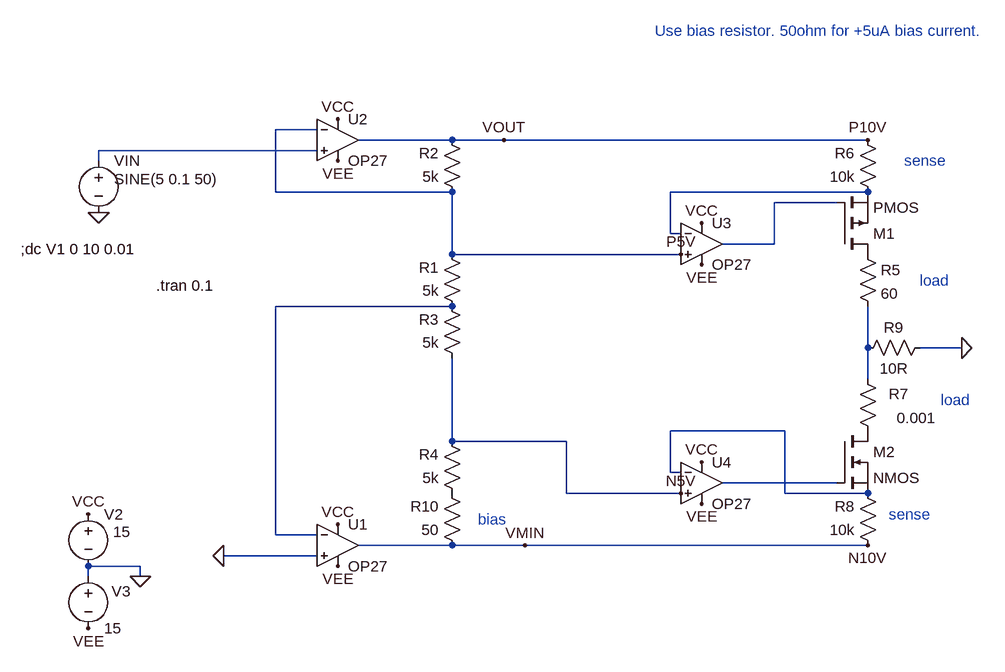
[diagram p0: schematic Draft31.asc]
Draft31.asc, the LTspice schematic file:
Version 4
SHEET 1 1452 940
WIRE 384 80 320 80
WIRE 592 96 448 96
WIRE 672 96 592 96
WIRE 1232 96 672 96
WIRE 384 112 48 112
WIRE 48 128 48 112
WIRE 320 176 320 80
WIRE 592 176 320 176
WIRE 1232 176 928 176
WIRE 1184 192 1088 192
WIRE 928 240 928 176
WIRE 944 240 928 240
WIRE 1088 256 1088 192
WIRE 1088 256 1008 256
WIRE 592 272 592 176
WIRE 944 272 592 272
WIRE 592 352 320 352
WIRE 1232 416 1232 352
WIRE 1376 416 1312 416
WIRE 1232 464 1232 416
WIRE 1104 544 928 544
WIRE 592 560 592 432
WIRE 768 560 592 560
WIRE 928 608 928 544
WIRE 944 608 928 608
WIRE 1184 624 1008 624
WIRE 768 640 768 560
WIRE 944 640 768 640
WIRE 1104 640 1104 544
WIRE 1232 640 1104 640
WIRE 320 704 320 352
WIRE 384 704 320 704
WIRE 592 720 448 720
WIRE 704 720 592 720
WIRE 1232 720 704 720
WIRE 384 736 240 736
WIRE 112 752 32 752
WIRE 32 768 32 752
WIRE 112 768 112 752
FLAG 48 208 0
FLAG 112 768 0
FLAG 672 96 VOUT
FLAG 32 672 VCC
FLAG 416 64 VCC
FLAG 32 848 VEE
FLAG 416 128 VEE
FLAG 416 688 VCC
FLAG 416 752 VEE
FLAG 704 720 VMIN
FLAG 240 736 0
FLAG 1232 96 P10V
FLAG 976 224 VCC
FLAG 976 288 VEE
FLAG 944 272 P5V
FLAG 976 592 VCC
FLAG 976 656 VEE
FLAG 1376 416 0
FLAG 1232 720 N10V
FLAG 944 640 N5V
SYMBOL voltage 48 112 R0
WINDOW 123 0 0 Left 0
WINDOW 39 0 0 Left 0
WINDOW 3 24 44 Left 2
SYMATTR Value SINE(5 0.1 50)
SYMATTR InstName VIN
SYMBOL voltage 32 656 R0
WINDOW 123 0 0 Left 0
WINDOW 39 0 0 Left 0
WINDOW 3 38 43 Left 2
SYMATTR Value 15
SYMATTR InstName V2
SYMBOL voltage 32 752 R0
WINDOW 123 0 0 Left 0
WINDOW 39 0 0 Left 0
WINDOW 0 36 39 Left 2
SYMATTR InstName V3
SYMATTR Value 15
SYMBOL res 608 192 R180
WINDOW 0 36 76 Left 2
WINDOW 3 36 40 Left 2
SYMATTR InstName R2
SYMATTR Value 5k
SYMBOL res 608 448 R180
WINDOW 0 36 76 Left 2
WINDOW 3 36 40 Left 2
SYMATTR InstName R3
SYMATTR Value 5k
SYMBOL OpAmps\\OP27 416 32 R0
SYMATTR InstName U2
SYMBOL OpAmps\\OP27 416 656 R0
SYMATTR InstName U1
SYMBOL res 608 368 R180
WINDOW 0 36 76 Left 2
WINDOW 3 36 40 Left 2
SYMATTR InstName R1
SYMATTR Value 5k
SYMBOL res 608 656 R180
WINDOW 0 36 76 Left 2
WINDOW 3 36 40 Left 2
SYMATTR InstName R4
SYMATTR Value 5k
SYMBOL res 1216 256 R0
SYMATTR InstName R5
SYMATTR Value 60
SYMBOL OpAmps\\OP27 976 192 R0
SYMATTR InstName U3
SYMBOL res 1248 192 R180
WINDOW 0 36 76 Left 2
WINDOW 3 36 40 Left 2
SYMATTR InstName R6
SYMATTR Value 10k
SYMBOL pmos 1184 272 M180
SYMATTR InstName M1
SYMBOL res 1248 560 R180
WINDOW 0 -47 73 Left 2
WINDOW 3 -89 36 Left 2
SYMATTR InstName R7
SYMATTR Value 0.001
SYMBOL OpAmps\\OP27 976 560 R0
SYMATTR InstName U4
SYMBOL res 1248 736 R180
WINDOW 0 36 76 Left 2
WINDOW 3 36 40 Left 2
SYMATTR InstName R8
SYMATTR Value 10k
SYMBOL nmos 1184 544 R0
SYMATTR InstName M2
SYMBOL res 1328 400 R90
WINDOW 0 0 56 VBottom 2
WINDOW 3 32 56 VTop 2
SYMATTR InstName R9
SYMATTR Value 10R
SYMBOL res 608 736 R180
WINDOW 0 36 76 Left 2
WINDOW 3 36 40 Left 2
SYMATTR InstName R10
SYMATTR Value 50
TEXT -72 264 Left 2 !;dc V1 0 10 0.01
TEXT 136 320 Left 2 !.tran 0.1
TEXT 1288 128 Left 2 ;sense
TEXT 1312 312 Left 2 ;load
TEXT 1264 672 Left 2 ;sense
TEXT 1344 496 Left 2 ;load
TEXT 904 -72 Left 2 ;Use bias resistor. 50ohm for +5uA bias current.
TEXT 632 680 Left 2 ;bias

The netlist it stands for:
* Draft31.asc
VIN N001 0 SINE(5 0.1 50)
V2 VCC 0 15
V3 0 VEE 15
R2 P5V P10V 5k
R3 N5V N004 5k
XU2 N001 P5V VCC VEE P10V OP27  ; pins In+ In- V+ V- OUT
XU1 0 N004 VCC VEE N10V OP27  ; pins In+ In- V+ V- OUT
R1 N004 P5V 5k
R4 P001 N5V 5k
R5 P002 N005 60
XU3 P5V N002 VCC VEE N003 OP27  ; pins In+ In- V+ V- OUT
R6 N002 P10V 10k
M1 P002 N003 N002 N002 PMOS
R7 P003 N005 0.001
XU4 N5V N006 VCC VEE N007 OP27  ; pins In+ In- V+ V- OUT
R8 N10V N006 10k
M2 P003 N007 N006 N006 NMOS
R9 0 N005 10R
R10 N10V P001 50
.model NMOS NMOS
.model PMOS PMOS
.lib standard.mos
;dc V1 0 10 0.01
.tran 0.1
* sense
* load
* sense
* load
* Use bias resistor. 50ohm for +5uA bias current.
* bias
.lib ADI.lib
.backanno
.end

* Results of the author's LTspice run, read from the files saved beside the schematic
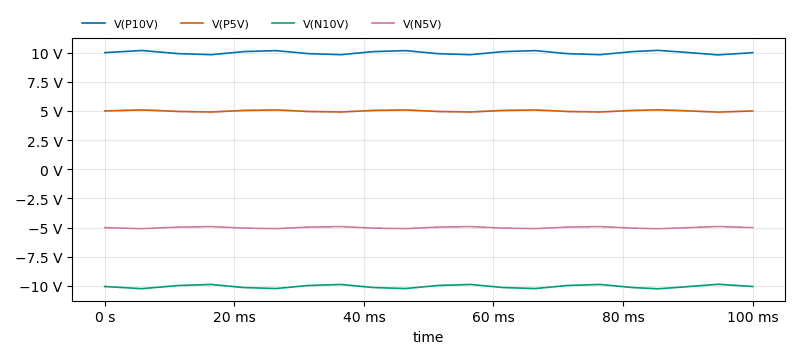
[diagram p1: Transient Analysis of Draft31.asc, plotted from the saved traces]
* Transient Analysis, 1 run:
*   V(P10V): min 9.809 V, max 10.2 V, average 10 V, rms 10 V, last 10 V
*   V(P5V): min 4.904 V, max 5.098 V, average 5 V, rms 5.001 V, last 5 V
*   V(N10V): min -10.25 V, max -9.858 V, average -10.05 V, rms 10.05 V, last -10.05 V
*   V(N5V): min -5.098 V, max -4.904 V, average -5 V, rms 5.001 V, last -5 V